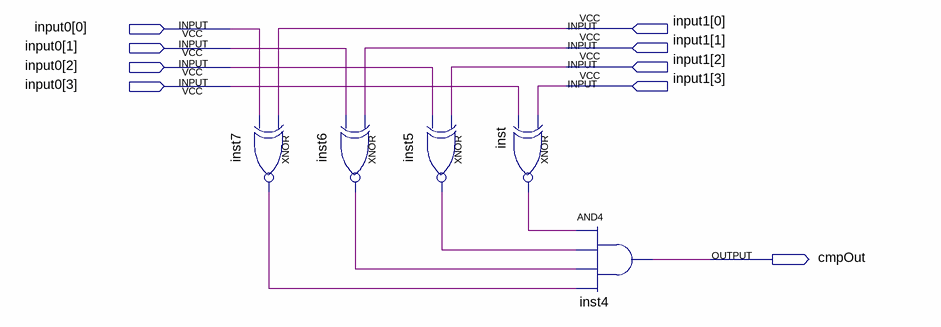
[diagram p0: schematic sheet]
// Quartus schematic EqCmp4.bdf as structural Verilog: 5 symbols, 9 pins
module EqCmp4 (
  input  [3:0] input0,
  input  [3:0] input1,
  output cmpOut
);

  wire inst5_out, inst6_out, inst7_out, inst_out;

  xnor inst7 (inst7_out, input1[0], input0[0]);
  xnor inst6 (inst6_out, input1[1], input0[1]);
  xnor inst5 (inst5_out, input1[2], input0[2]);
  xnor inst (inst_out, input1[3], input0[3]);
  and inst4 (cmpOut, inst_out, inst5_out, inst6_out, inst7_out);
endmodule
